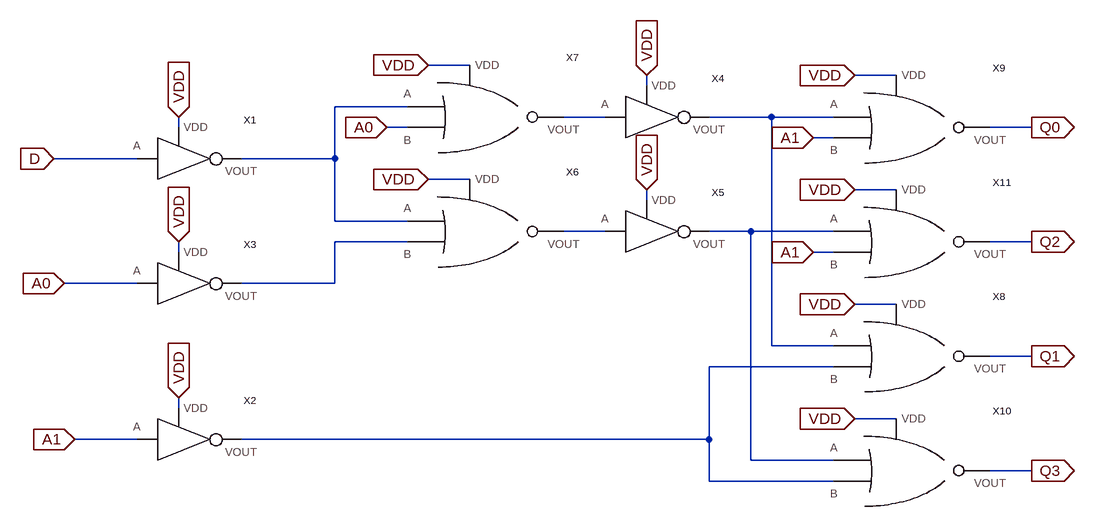
[diagram p0: schematic demux.asc]
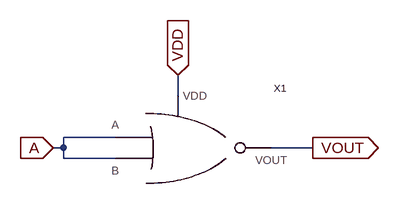
[diagram p1: sub-circuit not.asc]
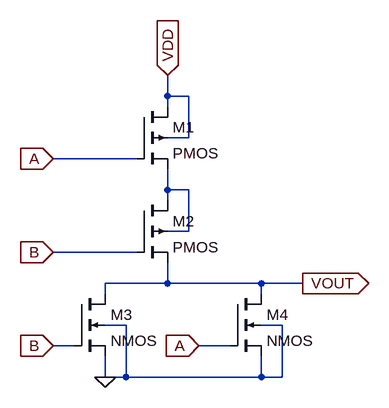
[diagram p2: sub-circuit nor.asc]
demux.asc, the LTspice schematic file:
Version 4.1
SHEET 1 1972 872
WIRE 656 32 592 32
WIRE 1312 48 1248 48
WIRE 928 64 928 48
WIRE 560 96 448 96
WIRE 864 112 800 112
WIRE 1120 112 1024 112
WIRE 1216 112 1120 112
WIRE 208 128 208 112
WIRE 560 128 528 128
WIRE 1520 128 1456 128
WIRE 1216 144 1184 144
WIRE 144 176 16 176
WIRE 448 176 448 96
WIRE 448 176 304 176
WIRE 656 208 592 208
WIRE 1312 224 1248 224
WIRE 928 240 928 224
WIRE 448 272 448 176
WIRE 560 272 448 272
WIRE 864 288 800 288
WIRE 1088 288 1024 288
WIRE 1216 288 1088 288
WIRE 560 304 448 304
WIRE 1520 304 1456 304
WIRE 208 320 208 304
WIRE 1216 320 1184 320
WIRE 144 368 32 368
WIRE 448 368 448 304
WIRE 448 368 304 368
WIRE 1312 400 1248 400
WIRE 1120 464 1120 112
WIRE 1216 464 1120 464
WIRE 1520 480 1456 480
WIRE 1216 496 1024 496
WIRE 208 560 208 544
WIRE 1312 576 1248 576
WIRE 144 608 48 608
WIRE 1024 608 1024 496
WIRE 1024 608 304 608
WIRE 1088 640 1088 288
WIRE 1216 640 1088 640
WIRE 1520 656 1456 656
WIRE 1024 672 1024 608
WIRE 1216 672 1024 672
FLAG 16 176 D
IOPIN 16 176 In
FLAG 48 608 A1
IOPIN 48 608 In
FLAG 32 368 A0
IOPIN 32 368 In
FLAG 528 128 A0
IOPIN 528 128 In
FLAG 1184 144 A1
IOPIN 1184 144 In
FLAG 1520 128 Q0
IOPIN 1520 128 Out
FLAG 1184 320 A1
IOPIN 1184 320 In
FLAG 1520 304 Q2
IOPIN 1520 304 Out
FLAG 1520 480 Q1
IOPIN 1520 480 Out
FLAG 1520 656 Q3
IOPIN 1520 656 Out
FLAG 1248 48 VDD
IOPIN 1248 48 In
FLAG 1248 224 VDD
IOPIN 1248 224 In
FLAG 1248 400 VDD
IOPIN 1248 400 In
FLAG 1248 576 VDD
IOPIN 1248 576 In
FLAG 592 32 VDD
IOPIN 592 32 In
FLAG 592 208 VDD
IOPIN 592 208 In
FLAG 928 48 VDD
IOPIN 928 48 In
FLAG 928 224 VDD
IOPIN 928 224 In
FLAG 208 112 VDD
IOPIN 208 112 In
FLAG 208 304 VDD
IOPIN 208 304 In
FLAG 208 544 VDD
IOPIN 208 544 In
SYMBOL not 208 176 R0
SYMATTR InstName X1
SYMBOL not 208 608 R0
SYMATTR InstName X2
SYMBOL not 208 368 R0
SYMATTR InstName X3
SYMBOL not 928 112 R0
SYMATTR InstName X4
SYMBOL not 928 288 R0
SYMATTR InstName X5
SYMBOL nor 672 288 R0
SYMATTR InstName X6
SYMBOL nor 672 112 R0
SYMATTR InstName X7
SYMBOL nor 1328 480 R0
SYMATTR InstName X8
SYMBOL nor 1328 128 R0
SYMATTR InstName X9
SYMBOL nor 1328 656 R0
SYMATTR InstName X10
SYMBOL nor 1328 304 R0
SYMATTR InstName X11

not.asc, the sub-circuit schematic file:
Version 4.1
SHEET 1 880 680
WIRE 224 96 224 64
WIRE 128 160 48 160
WIRE 48 176 48 160
WIRE 48 176 32 176
WIRE 432 176 368 176
WIRE 48 192 48 176
WIRE 128 192 48 192
FLAG 224 64 VDD
IOPIN 224 64 In
FLAG 32 176 A
IOPIN 32 176 In
FLAG 432 176 VOUT
IOPIN 432 176 Out
SYMBOL nor 240 176 R0
SYMATTR InstName X1

nor.asc, the sub-circuit schematic file:
Version 4.1
SHEET 1 1028 680
WIRE 272 80 272 48
WIRE 304 80 272 80
WIRE 272 96 272 80
WIRE 304 144 304 80
WIRE 304 144 272 144
WIRE 224 176 96 176
WIRE 272 224 272 192
WIRE 304 224 272 224
WIRE 272 240 272 224
WIRE 304 288 304 224
WIRE 304 288 272 288
WIRE 224 320 96 320
WIRE 272 368 272 336
WIRE 272 368 176 368
WIRE 416 368 272 368
WIRE 480 368 416 368
WIRE 176 384 176 368
WIRE 416 384 416 368
WIRE 208 432 176 432
WIRE 448 432 416 432
WIRE 128 464 96 464
WIRE 368 464 320 464
WIRE 176 512 176 480
WIRE 208 512 208 432
WIRE 208 512 176 512
WIRE 416 512 416 480
WIRE 416 512 208 512
WIRE 448 512 448 432
WIRE 448 512 416 512
FLAG 96 176 A
IOPIN 96 176 In
FLAG 272 48 VDD
IOPIN 272 48 In
FLAG 96 320 B
IOPIN 96 320 In
FLAG 480 368 VOUT
IOPIN 480 368 Out
FLAG 176 512 0
FLAG 320 464 A
IOPIN 320 464 In
FLAG 96 464 B
IOPIN 96 464 In
SYMBOL pmos4 224 96 R0
SYMATTR InstName M1
SYMATTR Value2 l=90n w=400n
SYMBOL pmos4 224 240 R0
SYMATTR InstName M2
SYMATTR Value2 l=90n w=400n
SYMBOL nmos4 368 384 R0
SYMATTR InstName M4
SYMATTR Value2 l=90n w=200n
SYMBOL nmos4 128 384 R0
SYMATTR InstName M3
SYMATTR Value2 l=90n w=200n

The netlist it stands for:
* demux.asc
X§X1 VDD D N001 not
X§X2 VDD A1 N007 not
X§X3 VDD A0 N006 not
X§X4 VDD N002 N003 not
X§X5 VDD N004 N005 not
X§X6 N001 N006 VDD N004 nor
X§X7 N001 A0 VDD N002 nor
X§X8 N003 N007 VDD Q1 nor
X§X9 N003 A1 VDD Q0 nor
X§X10 N005 N007 VDD Q3 nor
X§X11 N005 A1 VDD Q2 nor

* block symbol definitions
.subckt not VDD A VOUT
X§X1 A A VDD VOUT nor
.ends not

.subckt nor A B VDD VOUT
M1 VDD A N001 VDD PMOS l=90n w=400n
M2 N001 B VOUT N001 PMOS l=90n w=400n
M4 VOUT A 0 0 NMOS l=90n w=200n
M3 VOUT B 0 0 NMOS l=90n w=200n
.ends nor

.model NMOS NMOS
.model PMOS PMOS
.lib standard.mos
.backanno
.end